# EAGLE design Group 13 Layout and sch v4 (EAGLE 9.2.0)
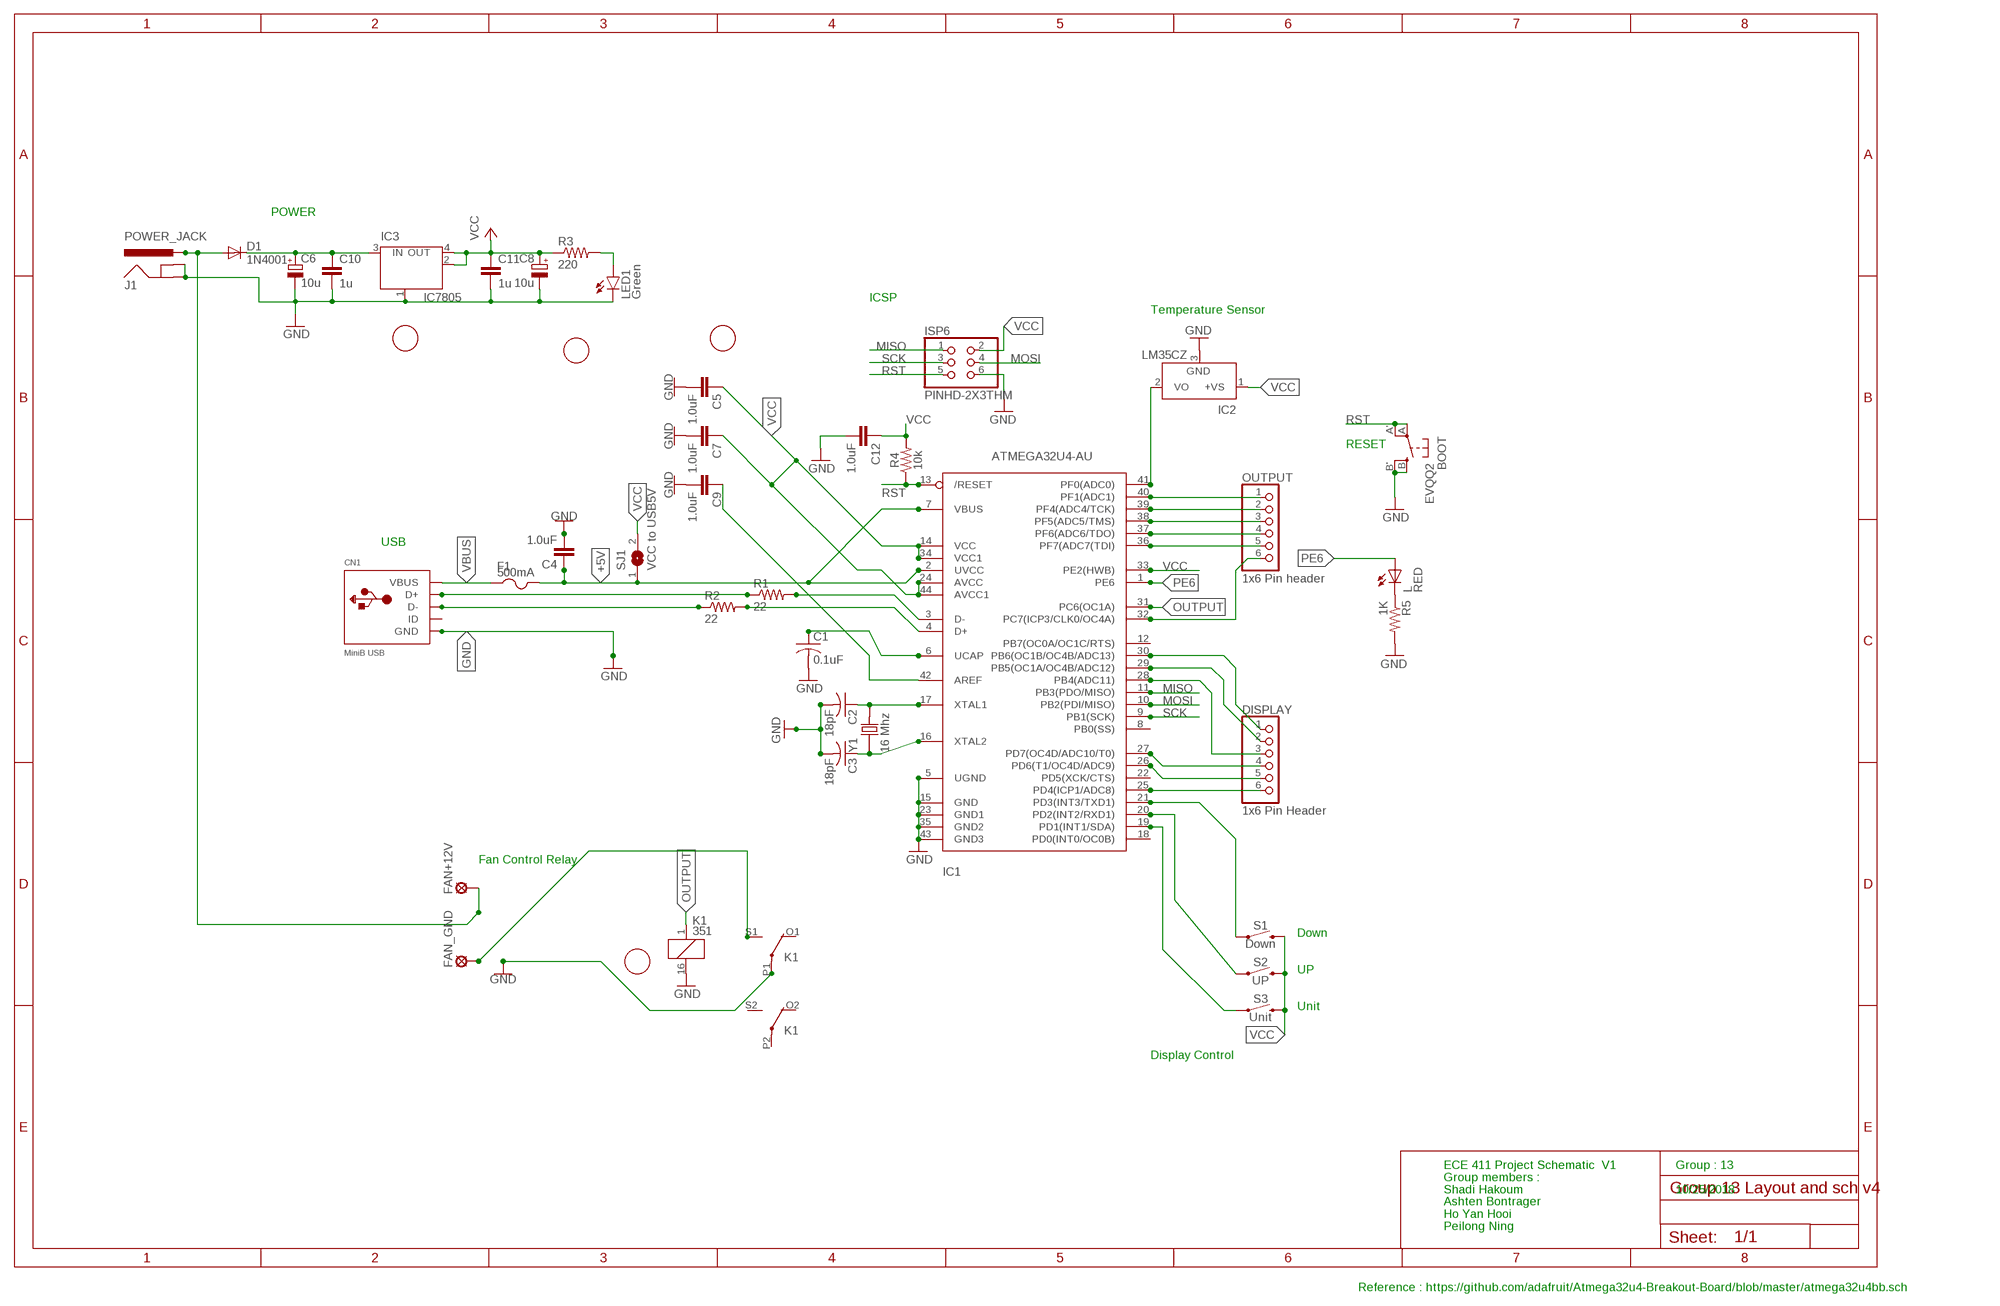
[diagram p0: schematic, sheet 1]

## Parts
BOOT  EVQQ2  [EVQ-Q2]
C1  0.1uF  C-USC0805K  [C0805K]
C2  18pF  C-USC0805K  [C0805K]
C3  18pF  C-USC0805K  [C0805K]
C4  1.0uF  1.0UF-0603-16V-10%  [0603]
C5  1.0uF  1.0UF-0603-16V-10%  [0603]
C6  10u  CPOL-EUC  [PANASONIC_C]
C7  1.0uF  1.0UF-0603-16V-10%  [0603]
C8  10u  CPOL-EUC  [PANASONIC_C]
C9  1.0uF  1.0UF-0603-16V-10%  [0603]
C10  1u  C-EUC0805  [C0805]
C11  1u  C-EUC0805  [C0805]
C12  1.0uF  1.0UF-0603-16V-10%  [0603]
CN1  MiniB USB  USBMINIB  [USB-MINIB]
D1  1N4001  BYT85  [DO220S]
DISPLAY  1x6 Pin Header  PINHD-1X6B  [1X06-BIG]
F1  500mA  PTCFUSE-1206  [R1206]
FAN+12V  LSP10  [LSP10]
FAN_GND  LSP11  [LSP11]
IC1  ATMEGA32U4-AU  [TQFP44]
IC2  LM35CZ  [TO92]
IC3  IC7805  MC33269ST-3.3T3  [SOT223]
ISP6  PINHD-2X3THM  [ISP6]
J1  POWER_JACK  [POWER_JACK_PTH]
K1  351  [351]
L  RED  LEDCHIPLED_0805  [CHIPLED_0805]
LED1  Green  LED5MM  [LED5MM]
OUTPUT  1x6 Pin header  PINHD-1X6B  [1X06-BIG]
R1  22  R-US_R0805  [R0805]
R2  22  R-US_R0805  [R0805]
R3  220  R-US_R0805  [R0805]
R4  10k  10KOHM-HORIZ_KIT-1/6W-5%  [AXIAL-0.3-KIT]
R5  1K  R-US_R0805  [R0805]
S1  Down  MOMENTARY-SWITCH-SPST-PTH-6.0MM  [TACTILE_SWITCH_PTH_6.0MM]
S2  UP  MOMENTARY-SWITCH-SPST-PTH-6.0MM  [TACTILE_SWITCH_PTH_6.0MM]
S3  Unit  MOMENTARY-SWITCH-SPST-PTH-6.0MM  [TACTILE_SWITCH_PTH_6.0MM]
SJ1  VCC to USB5V  SJ  [SJ]
U$1  FIDUCIAL  [FIDUCIAL_1MM]
U$2  FIDUCIAL  [FIDUCIAL_1MM]
U$3  FIDUCIAL  [FIDUCIAL_1MM]
U$6  FIDUCIAL  [FIDUCIAL_1MM]
Y1  16 Mhz  ECS-160-20-1X  [XTAL_ECS-160-20-1X]

## Nets
3.3V: C1.1 IC1.6(UCAP)
+5V: C4.1 F1.2 IC1.2(UVCC) IC1.7(VBUS) SJ1.1
D+: CN1.D+ R1.1
D-: CN1.D- R2.1
GND: BOOT.B'(S1) BOOT.B(S) C1.2 C2.2 C3.2 C4.2 C5.2 C6.- C7.2 C8.- C9.2 C10.2 C11.2 C12.2 CN1.GND IC1.5(UGND) IC1.15(GND) IC1.23(GND1) IC1.35(GND2) IC1.43(GND3) IC2.3(GND) IC3.1(GND/ADJ) ISP6.6 J1.GND J1.GNDBREAK K1.16 K1.P1(2:P) LED1.K(C) R5.2
MISO: IC1.11(PB3(PDO/MISO)) ISP6.1
MOSI: IC1.10(PB2(PDI/MISO)) ISP6.4
N$1: DISPLAY.6 IC1.25(PD4(ICP1/ADC8))
N$2: C6.+ C10.1 D1.C IC3.3(IN)
N$3: IC1.3(D-) R1.2
N$4: IC1.4(D+) R2.2
N$5: LED1.A R3.2
N$7: IC1.40(PF1(ADC1)) OUTPUT.1
N$8: C2.1 IC1.17(XTAL1) Y1.2
N$9: C3.1 IC1.16(XTAL2) Y1.1
N$10: L.C R5.1
N$11: IC1.38(PF5(ADC5/TMS)) OUTPUT.3
N$12: DISPLAY.5 IC1.26(PD6(T1/OC4D/ADC9))
N$13: FAN_GND.MP K1.S1(2:S)
N$16: DISPLAY.4 IC1.27(PD7(OC4D/ADC10/T0))
N$17: DISPLAY.3 IC1.28(PB4(ADC11))
N$18: DISPLAY.2 IC1.29(PB5(OC1A/OC4B/ADC12))
N$19: DISPLAY.1 IC1.30(PB6(OC1B/OC4B/ADC13))
N$20: IC1.19(PD1(INT1/SDA)) S3.1
N$21: IC1.20(PD2(INT2/RXD1)) S2.1
N$22: IC1.21(PD3(INT3/TXD1)) S1.1
N$24: IC1.37(PF6(ADC6/TDO)) OUTPUT.4
N$25: IC1.36(PF7(ADC7(TDI)) OUTPUT.5
N$26: IC1.32(PC7(ICP3/CLK0/OC4A)) OUTPUT.6
N$28: C9.1 IC1.42(AREF)
N$29: D1.A FAN+12V.MP J1.PWR
OUTPUT: IC1.31(PC6(OC1A)) K1.1
PE6: IC1.1(PE6) L.A
PF4: IC1.39(PF4(ADC4/TCK)) OUTPUT.2
PF7: IC1.41(PF0(ADC0)) IC2.2(VO)
RST: BOOT.A'(P1) BOOT.A(P) IC1.13(/RESET) ISP6.5 R4.P$1
SCK: IC1.9(PB1(SCK)) ISP6.3
VBUS: CN1.VBUS F1.1
VCC: C5.1 C7.1 C8.+ C11.1 C12.1 IC1.14(VCC) IC1.24(AVCC) IC1.33(PE2(HWB)) IC1.34(VCC1) IC1.44(AVCC1) IC2.1(+VS) IC3.2(OUT) IC3.4(OUT) ISP6.2 R3.1 R4.P$2 S1.3 S2.3 S3.3 SJ1.2
Unconnected: CN1.ID IC1.8(PB0(SS)) IC1.12(PB7(OC0A/OC1C/RTS)) IC1.18(PD0(INT0/OC0B)) IC1.22(PD5(XCK/CTS)) K1.O1(2:O) K1.O2(3:O) K1.P2(3:P) K1.S2(3:S)

## Notes on the sheet
- POWER
- ICSP
- Temperature Sensor
- RESET
- USB
- Fan Control Relay
- Down
- UP
- Unit
- Display Control
- ECE 411 Project Schematic  V1 | Group : 13
- Group members :
- Shadi Hakoum | 10/25/2018
- Ashten Bontrager
- Ho Yan Hooi
- Peilong Ning
- Reference : https://github.com/adafruit/Atmega32u4-Breakout-Board/blob/master/atmega32u4bb.sch

## Library data of the parts
BOOT = adaprog:EVQQ2
C1-C3 = adafruit:C-US: CAPACITOR, American symbol
C4 C5 C7 C9 C12 = SparkFun-Capacitors:1.0UF: 1µF ceramic capacitors A capacitor is a passive two-terminal electrical component used to store electrical energy temporarily in an electric field.; PROD_ID: CAP-00868
C6 C8 = rcl:CPOL-EU: POLARIZED CAPACITOR, European symbol; SPICEPREFIX: C
C10 C11 = rcl:C-EU: CAPACITOR, European symbol; SPICEPREFIX: C
CN1 = adafruit:USB: USB Connectors USBMINIB - Surface Mount Female Mini-B USB Connector 4UConnector: 06564 By microbuilder.eu Thru-hole RA Female Mini-B USB Connector 4UConnector: 18732 By ladyada.net
D1 = diode:BYT85: DIODE
DISPLAY OUTPUT = adafruit:PINHD-1X6: PIN HEADER
F1 = adafruit:PTCFUSE: PTC fuses, resettable thermistors
FAN+12V = solpad:LSP10: SOLDER PAD drill 1.0 mm, distributor Buerklin, 12H555
FAN_GND = solpad:LSP11: SOLDER PAD drill 1.1 mm
IC1 = adaprog:ATMEGA32U4
IC2 = lm35:LM35: Single-Supply Centigrade Temperature Sensor Vout = (10mV/°C x Temp °C) +5mmmV Source: http://www.national.com/ds/LM/LM35.pdf
IC3 = linear:MC33269ST*: Adjustable Output Low Dropout Voltage Regulator 800 mA Source: http://www.onsemi.com/pub/Collateral/MC33269-D.PDF
ISP6 = adaprog:PINHD-2X3
J1 = SparkFun-Connectors:POWER_JACK: Power Jack Connector This is the standard 5.5mm barrel jack for power. The PTH is the most common, proven, reliable, footprint. The Slot footprint only works if the mill layer is transmitted to the PCB fab house so be warned. Here are the connectors we sell at SparkFun: DC Barrel Power Jack/Connector <https://www.sparkfun.com/products/119> (PRT-00119) DC Barrel Power Jack/Connector (SMD) <https://www.sparkfun.com/products/12748> (PRT-12748) DC Barrel Jack Adapter - Breadboard Compatible <https://www.sparkfun.com/products/10811> (PRT-10811) It is used on this SparkFun product (and many, many others): SparkFun RedBoard - Programmed with Arduino <https://www.sparkfun.com/products/12757> (DEV-12757) Also, if you need a mating power supply or connector, please check these out: Wall Adapter Power Supply - 9VDC 650mA <https://www.sparkfun.com/products/298> (TOL-00298) DC Barrel Jack Adapter - Male <https://www.sparkfun.com/products/10287> (PRT-10287); PROD_ID: CONN-08197
K1 = relay:351: RELAY 2 x switch, Omron; OC_FARNELL: unknown; OC_NEWARK: unknown
L = adafruit:LED: LED
LED1 = led:LED: LED
R1 R2 R5 = adafruit:R-US_: RESISTOR, American symbol
R3 = rcl:R-US_: RESISTOR, American symbol; SPICEPREFIX: R
R4 = SparkFun-Resistors:10KOHM: 10kΩ resistor A resistor is a passive two-terminal electrical component that implements electrical resistance as a circuit element. Resistors act to reduce current flow, and, at the same time, act to lower voltage levels within circuits. - Wikipedia; PROD_ID: RES-08375
S1-S3 = SparkFun-Switches:MOMENTARY-SWITCH-SPST: Momentary Switch (Pushbutton) - SPST Normally-open (NO) SPST momentary switches (buttons, pushbuttons). Variants PTH-12MM - 12mm square, through-hole Momentary Pushbutton Switch - 12mm Square <https://www.sparkfun.com/products/9190> (COM-09190) PTH-6.0MM, PTH-6.0MM-KIT - 6.0mm square, through-hole Mini Pushbutton Switch <https://www.sparkfun.com/products/97> (COM-00097) KIT package intended for soldering kit's - only one side of pads' copper is exposed. PTH-RIGHT-ANGLE-KIT - Right-angle, through-hole Right Angle Tactile Button <https://www.sparkfun.com/products/10791> - Used on SparkFun BigTime Watch Kit <https://www.sparkfun.com/products/11734> SMD-12MM - 12mm square, surface-mount Tactile Button - SMD (12mm) <https://www.sparkfun.com/products/12993> (COM-12993) Used on SparkFun PicoBoard <https://www.sparkfun.com/products/11888> SMD-4.5MM - 4.5mm Square Trackball Switch Used on SparkFun Blackberry Trackballer Breakout <https://www.sparkfun.com/products/13169> SMD-4.6MMX2.8MM - 4.60mm x 2.80mm, surface mount Used on SparkFun SAMD21 Mini Breakout <https://www.sparkfun.com/products/13664> SMD-5.2MM, SMD-5.2-REDUNDANT - 5.2mm square, surface-mount Mini Pushbutton Switch - SMD <https://www.sparkfun.com/products/8720> (COM-08720) Used on Arduino Pro Mini <https://www.sparkfun.com/products/11114> REDUNDANT package connects both switch circuits together SMD-6.0X3.5MM - 6.0 x 3.5mm, surface mount Momentary Reset Switch SMD <https://www.sparkfun.com/products/8229> (COM-08229) SMD-6.2MM-TALL - 6.2mm square, surface mount Tactile Button - SMD (6mm) <https://www.sparkfun.com/products/12992> Used on SparkFun Digital Sandbox <https://www.sparkfun.com/products/12651> SMD-RIGHT-ANGLE - Right-angle, surface mount Used on SparkFun Block for Intel® Edison - Arduino <https://www.sparkfun.com/products/13036>; PROD_ID: SWCH-08441; SF_SKU: COM-00097
SJ1 = jumper:SJ: SMD solder JUMPER
U$1-U$3 U$6 = adafruit:FIDUCIAL: For use by pick and place machines to calibrate the vision/machine, 1mm By microbuilder.eu
Y1 = ECS-160-20-1X:ECS-160-20-1X: Crystal HC49/U T/H; DESCRIPTION: Crystal 16MHz ±30ppm _Tol_ ±50ppm _Stability_ 20pF FUND 20Ohm 2-Pin HC-49/UX Thru-Hole Bulk; DIGI-KEY_PART_NUMBER: X1033-ND; DIGI-KEY_PURCHASE_URL: https://www.digikey.com/product-detail/en/ecs-inc/ECS-160-20-1X/X1033-ND/827525?utm_source=snapeda&utm_medium=aggregator&utm_campaign=symbol; MF: ECS Inc.; MP: ECS-160-20-1X; PACKAGE: HC49/U ECS International

## Board
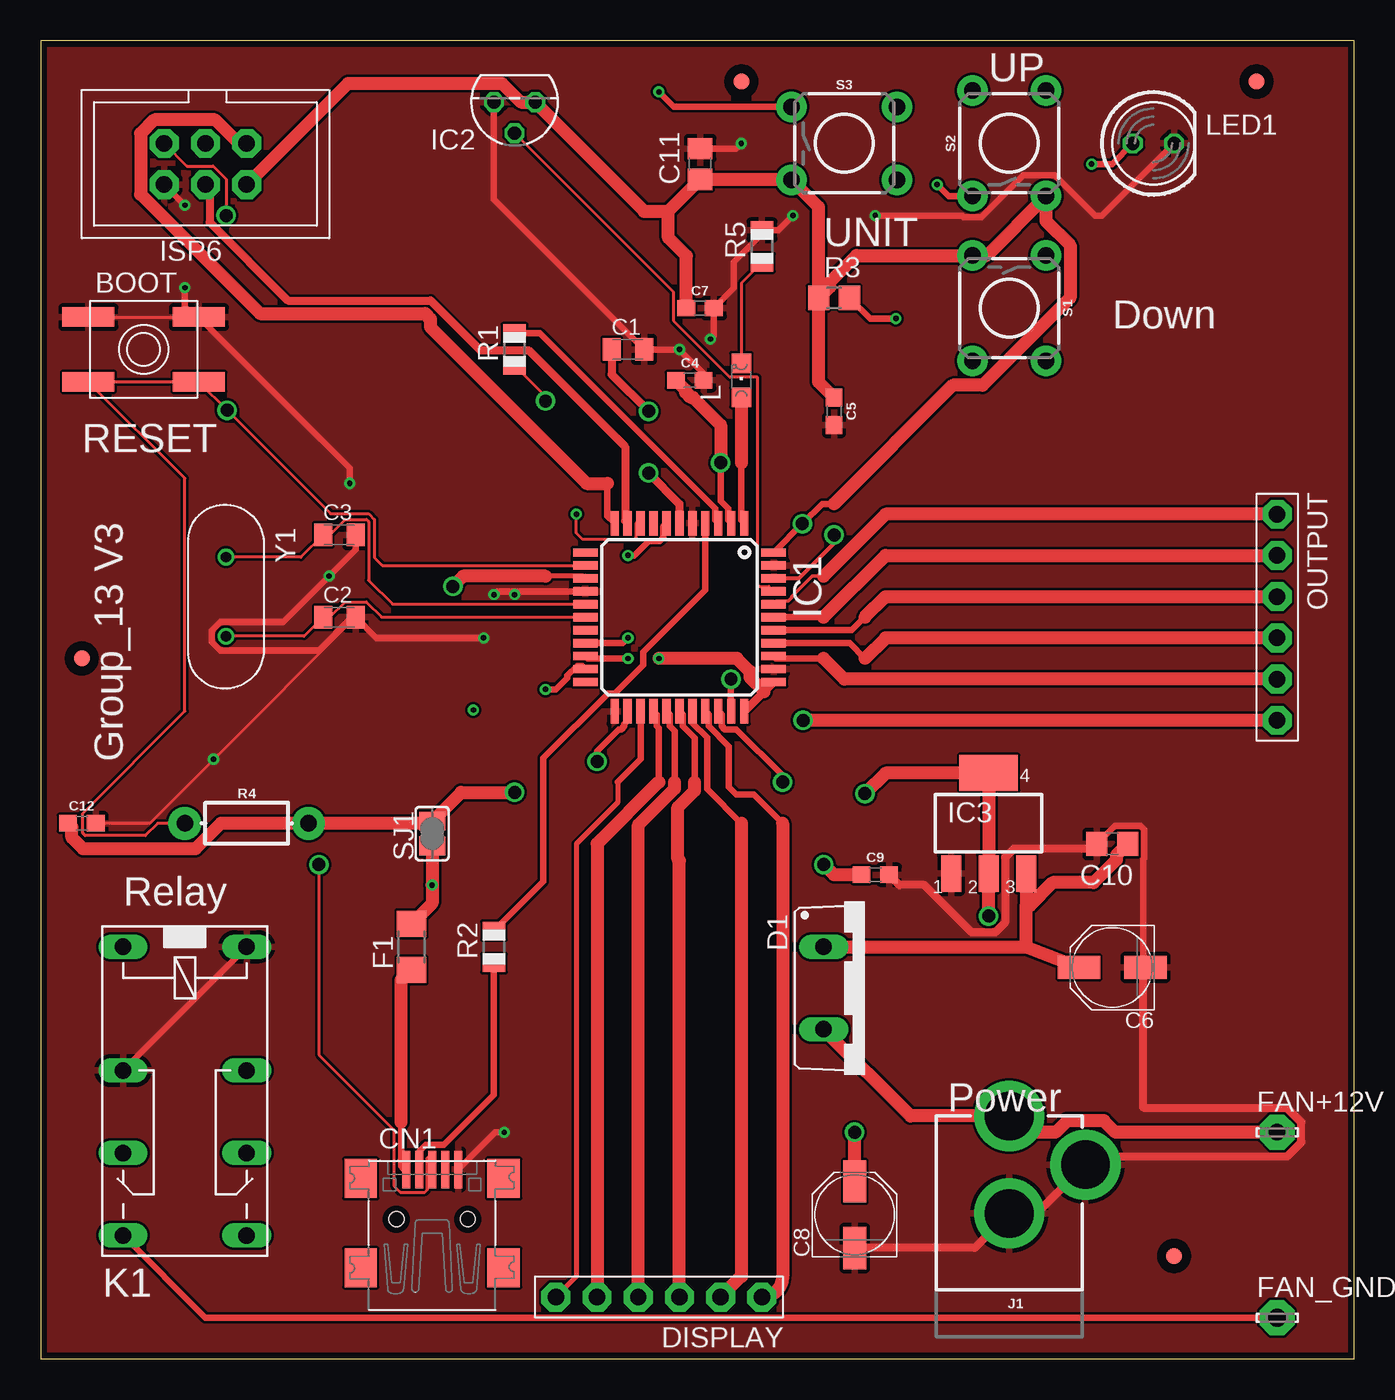
[diagram p1: board, top side]
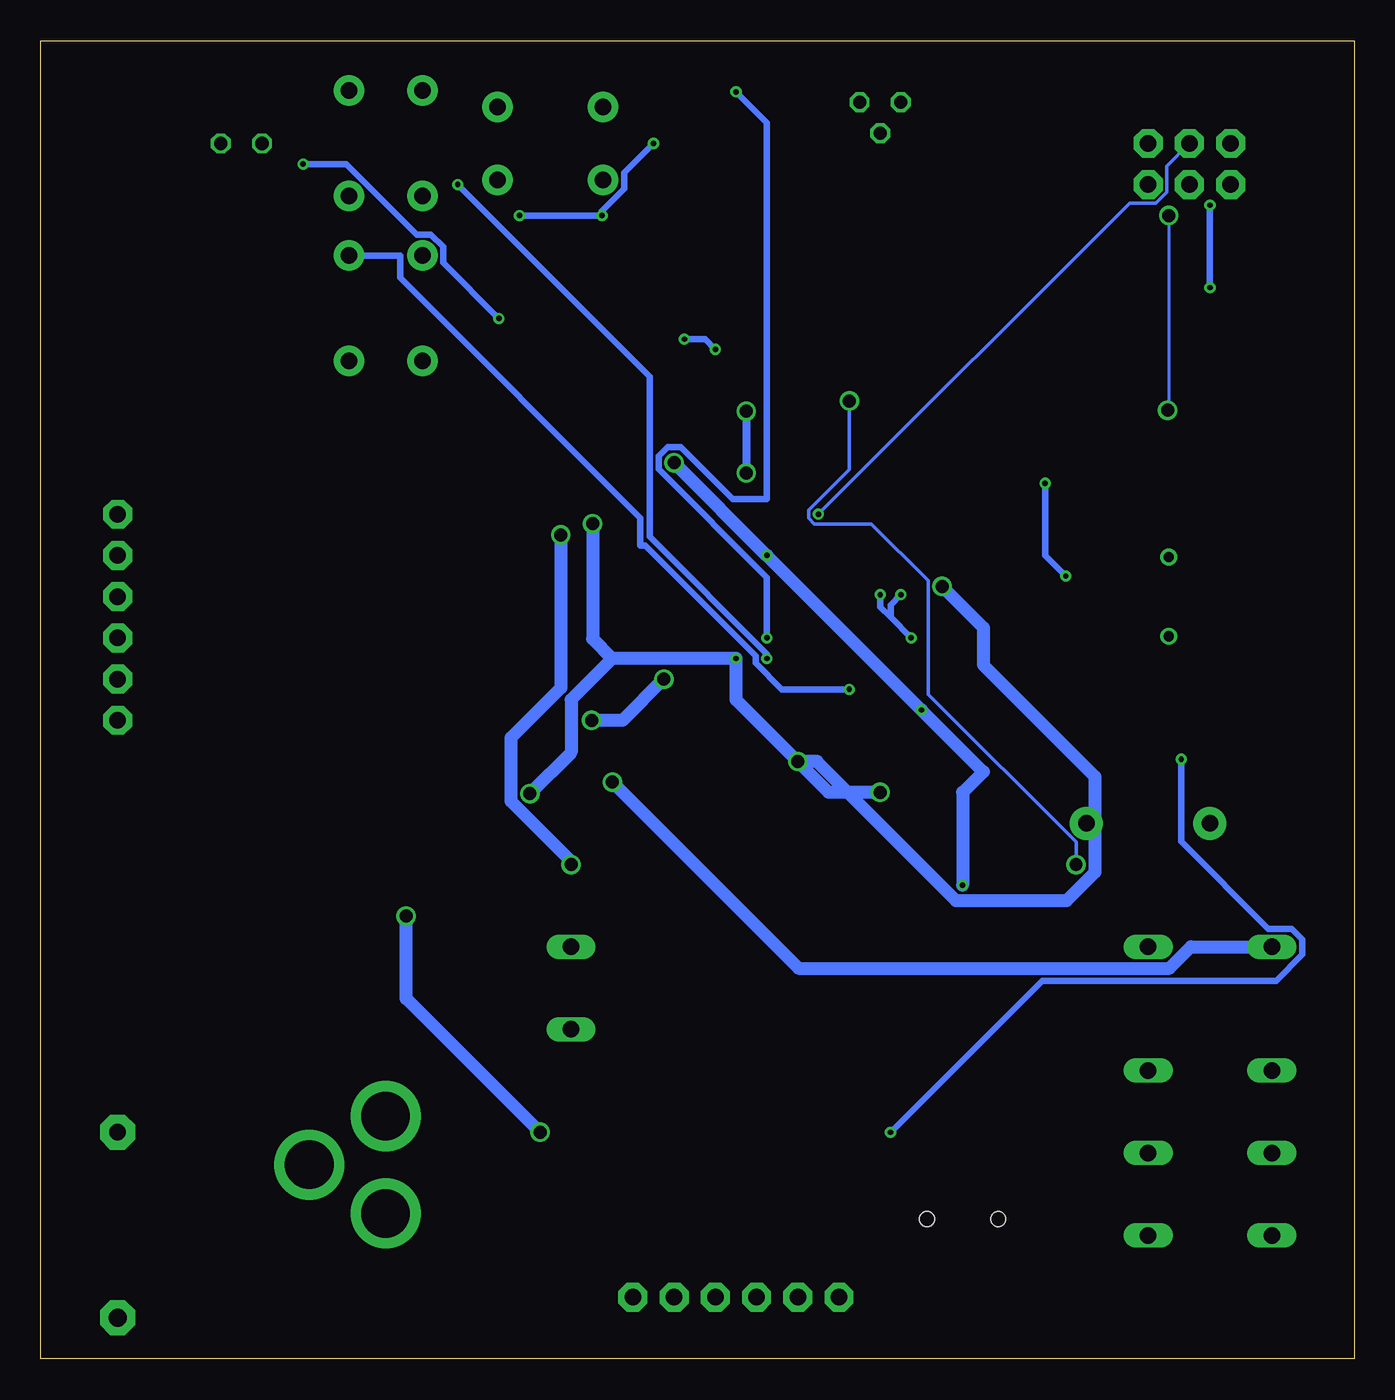
[diagram p2: board, bottom side, seen from below]

Size 80.95 x 81.27 mm. Coordinates in mm from the lower left corner, seen from the top.
Outline: 0,0 80.95,0 80.95,81.27 0,81.27 0,0
Copper layers (1*16): Top 0.0356mm / dielectric 1.5011mm / Bottom 0.0356mm
Design rules "LaenPCBOrder": minimum track width 6mil, minimum drill 13mil, track to track 6mil, track to pad 6mil, pad to pad 6mil, via to via 6mil, smd to smd 6mil, copper to edge 15mil, drill to drill 6mil, minimum pad ring 7mil, minimum via ring 7mil, stop-mask expansion 3mil, vias tented up to drill 0mil, thermal gap 10mil

### Footprints (pad centres in the part's own frame; a part is rotated, then mirrored left to right if it is on the bottom)
EVQ-Q2 = smd 3.2 x 1.2: A -3.4,-2; A' 3.4,-2; B -3.4,2; B' 3.4,2
C0805K = smd 1.1 x 1.4: 1 -1,0; 2 1,0
0603 = smd 1.1 x 1: 1 -0.85,0; 2 0.85,0
PANASONIC_C = smd 2.6 x 1.4: + 2.05,0; - -2.05,0
C0805 = smd 1.3 x 1.5: 1 -0.95,0; 2 0.95,0
USB-MINIB = smd 0.5 x 2.308: D+ 0,4.064; D- -0.8,4.064; GND 1.6,4.064; ID 0.8,4.064; VBUS -1.6,4.064 | smd 2 x 2.4: GND1 -4.4,-2; GND2 -4.4,3.5; GND3 4.4,3.5; GND4 4.4,-2 | hole 0.9: -2.2,1; 2.2,1
DO220S = drill 1.016 long: A 2.54,-2.54; C -2.54,-2.54
1X06-BIG = drill 1.016 pad 1.778 octagon: 1 -6.35,0; 2 -3.81,0; 3 -1.27,0; 4 1.27,0; 5 3.81,0; 6 6.35,0
R1206 = smd 1.6 x 1.803: 1 -1.422,0; 2 1.422,0
LSP10 = drill 1.016 pad 2.159 octagon: MP 0,0
LSP11 = drill 1.118 pad 2.159 octagon: MP 0,0
TQFP44 = smd 1.5 x 0.5: 1 -5.8,4; 2 -5.8,3.2; 3 -5.8,2.4; 4 -5.8,1.6; 5 -5.8,0.8; 6 -5.8,0; 7 -5.8,-0.8; 8 -5.8,-1.6; 9 -5.8,-2.4; 10 -5.8,-3.2; 11 -5.8,-4; 23 5.8,-4; 24 5.8,-3.2; 25 5.8,-2.4; 26 5.8,-1.6; 27 5.8,-0.8; 28 5.8,0; 29 5.8,0.8; 30 5.8,1.6; 31 5.8,2.4; 32 5.8,3.2; 33 5.8,4 | smd 0.5 x 1.5: 12 -4,-5.8; 13 -3.2,-5.8; 14 -2.4,-5.8; 15 -1.6,-5.8; 16 -0.8,-5.8; 17 0,-5.8; 18 0.8,-5.8; 19 1.6,-5.8; 20 2.4,-5.8; 21 3.2,-5.8; 22 4,-5.8; 34 4,5.8; 35 3.2,5.8; 36 2.4,5.8; 37 1.6,5.8; 38 0.8,5.8; 39 0,5.8; 40 -0.8,5.8; 41 -1.6,5.8; 42 -2.4,5.8; 43 -3.2,5.8; 44 -4,5.8
TO92 = drill 0.813 octagon: 1 -1.27,0; 2 0,1.905; 3 1.27,0
SOT223 = smd 1.219 x 2.235: 1 -2.311,-3.099; 2 0,-3.099; 3 2.311,-3.099 | smd 3.6 x 2.2: 4 0,3.099
ISP6 = drill 1.016 pad 1.778 octagon: 1 -2.54,-1.27; 2 -2.54,1.27; 3 0,-1.27; 4 0,1.27; 5 2.54,-1.27; 6 2.54,1.27
POWER_JACK_PTH = drill 2.997 pad 4.318: GND 0,7.7; GNDBREAK 4.7,10.7; PWR 0,13.7
351 = drill 1.016 long: 1 -3.81,-3.81; 16 -3.81,3.81; O1 8.89,-3.81; O2 8.89,3.81; P1 3.81,-3.81; P2 3.81,3.81; S1 13.97,-3.81; S2 13.97,3.81
CHIPLED_0805 = smd 1.2 x 1.2: A 0,-1.05; C 0,1.05
LED5MM = drill 0.813 octagon: A -1.27,0; K 1.27,0
R0805 = smd 1.1 x 1.4: 1 -1,0; 2 1,0
R0805' = smd 1.3 x 1.5: 1 -0.95,0; 2 0.95,0
AXIAL-0.3-KIT = drill 1.016 pad 2.032: P$1 -3.81,0; P$2 3.81,0
TACTILE_SWITCH_PTH_6.0MM = drill 1.016 pad 1.88: 1 -3.251,2.261; 2 3.251,2.261; 3 -3.251,-2.261; 4 3.251,-2.261
SJ = smd 1.168 x 1.6: 1 -0.762,0; 2 0.762,0
FIDUCIAL_1MM = smd 1 x 1: 1 0,0
XTAL_ECS-160-20-1X = drill 0.63 pad 1.03: 1 -2.44,0; 2 2.44,0

### Placement (x,y rotation side)
BOOT  6.35,62.23 0 top
C1  36.2,62.23 0 top
C2  18.41,45.72 0 top
C3  18.41,50.8 0 top
C4  40.01,60.33 0 top
C5  48.9,58.42 270 top
C6  66.04,24.13 180 top
C7  40.64,64.77 0 top
C8  50.16,8.89 90 top
C9  51.44,29.84 0 top
C10  66.04,31.75 180 top
C11  40.64,73.66 90 top
C12  2.54,33.02 0 top
CN1  24.13,7.62 0 top
D1  50.8,22.86 270 top
DISPLAY  38.1,3.81 180 top
F1  22.86,25.4 90 top
FAN+12V  76.2,13.97 0 top
FAN_GND  76.2,2.54 0 top
IC1  39.37,45.72 270 top
IC2  29.21,77.47 180 top
IC3  58.42,33.02 0 top
ISP6  10.16,73.66 180 top
J1  59.69,1.27 0 top
K1  8.89,21.59 270 top
L  43.18,60.33 0 top
LED1  68.58,74.93 0 top
OUTPUT  76.2,45.72 270 top
R1  29.21,62.23 90 top
R2  27.94,25.4 90 top
R3  220  [R0805']  48.9,65.41 0 top
R4  12.7,33.02 0 top
R5  44.45,68.58 90 top
S1  59.69,64.77 270 top
S2  59.69,74.93 90 top
S3  49.53,74.93 0 top
SJ1  24.13,32.38 90 top
U$1  74.93,78.74 0 top
U$2  43.18,78.74 0 top
U$3  69.85,6.35 0 top
U$6  2.54,43.18 0 top
Y1  11.43,46.99 270 top

### Tracks (layer width: path | path; a pad name or v marks a point on that pad's centre or on a via)
3.3V  (via drill 0.8)
  Top 0.508: C1.1 35.2,60.69 v37.47,58.42 | v37.47,54.61 39.37,52.7 IC1.6
  Bottom 0.508: v37.47,58.42 v37.47,54.61
+5V  (via drill 0.33, 0.8)
  Top 0.406: IC1.2 42.38,51.71 42.38,52.42 41.91,52.88 v41.91,55.24 | IC1.7 38.38,51.33 38.38,50.62 38.17,50.41 37.47,50.41 36.58,49.53 v36.2,49.53
  Top 0.813: SJ1.1 v24.13,29.21 24.13,28.09 F1.2 | v41.91,55.24 41.91,57.57 40.21,59.27 40.07,59.27 39.75,59.59 39.75,59.73 C4.1
  Bottom 0.813: v41.91,55.24 v36.2,49.53 v26.67,40.01 22.86,36.2 24.13,34.92 v24.13,29.21
D+  (via drill 0.8)
  Top 0.2: R1.1 31.11,59.33 v31.11,59.05 | v17.14,30.48 17.14,18.75 21.77,14.13 21.77,10.68 22.18,10.28 23.68,10.28 23.83,10.43 23.83,12.4 24.13,12.7 CN1.D+
  Bottom 0.203: v17.14,30.48 17.14,31.86 26.25,40.97 26.25,47.98 29.75,51.47 33.27,51.47 33.62,51.82 33.62,52.32 31.11,54.82 v31.11,59.05
D-
  Top 0.406: R2.1 27.94,16.29 24.84,13.19 23.73,13.19 23.38,12.84 23.38,11.73 CN1.D-
GND  (via drill 0.33)
  Top 0.2: 65.07,31.59 64.93,31.59 | C2.2 v10.66,36.97 6.71,33.02 C12.2 | BOOT.B 9.53,64.23 BOOT.B'
  Top 0.254: 56.3,29.92 IC3.1 | 64.93,31.59 C10.2
  Top 0.406: LED1.K 65.41,70.48 64.98,70.48 62.49,72.97 60.56,72.97 57.97,70.38 56.89,70.38 56.79,70.48 v51.44,70.48 | v46.35,70.48 45.45,69.58 R5.2 44.45,69.33 42.72,67.61 42.72,66 C7.2 41.49,63.08 v41.27,62.87 | IC2.3 27.94,71.48 C1.2 v39.37,62.23 40.85,60.74 C4.2 | C11.2 42.86,74.61 v43.18,74.93 | ISP6.6 v8.89,71.12 | v8.89,66.04 8.89,64.86 9.53,64.23 | BOOT.B' 19.05,54.93 v19.05,53.98 | C3.2 19.41,49.9 v17.78,48.26 14.94,45.42 11.07,45.42 10.56,44.91 10.56,44.19 11.07,43.68 17.13,43.68 19.17,45.72 C2.2 20.68,44.45 v27.3,44.45 | 44.62,48.92 IC1.43 | K1.P1 K1.16 | C10.2 65.98,32.64 65.98,32.65 66.19,32.86 67.79,32.86 68,32.65 68,30.85 67.94,30.8 67.94,23.98 | 67.94,23.5 67.94,23.98 | 67.94,23.98 C6.- | CN1.GND 28.02,13.97 v28.57,13.97 | IC1.15 28.14,47.32 v27.94,47.12
  Top 0.508: C8.- 57.56,6.84 J1.GND 61.39,8.97 J1.GNDBREAK 64.9,12.48 76.81,12.48 77.69,13.36 77.69,14.59 76.81,15.46 68.01,15.46 67.94,15.53 67.94,23.98 | C10.2 64.78,31.45 59.95,31.45 59.44,30.93 59.44,26.9 58.84,26.3 57.37,26.3 54.46,29.21 52.92,29.21 C9.2
  Bottom 0.406: v51.44,70.48 v46.35,70.48 46.35,70.76 44.98,72.13 44.98,73.13 v43.18,74.93 | v41.27,62.87 40.01,62.87 v39.37,62.23 | v8.89,71.12 v8.89,66.04 | v19.05,53.98 19.05,49.53 v17.78,48.26 | v27.3,44.45 28.57,45.72 | 28.57,45.72 29.21,46.35 v29.21,47.12 | v10.66,36.97 10.66,31.89 5.29,26.52 3.85,26.52 3.2,25.86 3.2,24.94 4.82,23.32 19.23,23.32 v28.57,13.97 | v27.94,47.12 28.57,46.48 28.57,45.72
  pour Top: 0,81.28 81.28,81.28 81.28,0 0,0
MISO
  Top 0.406: 34.92,53.98 34.92,51.97 IC1.11
  Top 0.813: 34.92,53.98 33.66,53.98 24.02,63.61 24.02,64.11 23.69,64.44 13.52,64.44 6.17,71.79 6.17,75.53 7.02,76.38 10.76,76.38 12.21,74.93 ISP6.1
MOSI
  Top 0.508: IC1.10 36.03,51.66 36.03,56.24 30.08,62.19 27.09,62.19 24.03,65.25 15.24,65.25 10.42,70.07 10.42,72.13 ISP6.4
N$1
  Top 0.305: 35.56,35.56 35.56,34.29 33.02,31.75 33.02,5.08 DISPLAY.6
  Top 0.406: IC1.25 36.97,36.97 35.56,35.56
N$2
  Top 0.813: D1.C 60.73,25.4 | 60.73,25.4 60.73,27.94 | IC3.3 60.73,27.94 | 60.73,25.4 C6.+ | C10.1 66.3,31.06 66.3,30.77 64.89,29.36 62.38,29.36 60.96,27.94 60.73,27.94
N$3
  Top 0.406: IC1.3 41.58,51.71 41.58,52.42 30.76,63.23 R1.2
N$4
  Top 0.406: R2.2 30.99,29.45 30.99,37.04 34.97,41.03 35.39,41.03 37.14,42.78 37.14,43.58 40.97,47.4 IC1.4
N$5  (via drill 0.33)
  Top 0.406: LED1.A 66.04,73.66 v64.77,73.66 | v52.7,64.14 51.12,64.14 R3.2
  Bottom 0.406: v52.7,64.14 56.13,67.56 56.13,68.56 56.89,69.32 57.76,69.32 62.1,73.66 v64.77,73.66
N$7
  Top 0.203: 48.26,48.26 47.55,48.26 46.28,46.99 46.28,46.92 46.07,46.71 45.36,46.71 IC1.40
  Top 0.813: OUTPUT.1 52.07,52.07 48.26,48.26
N$8
  Top 0.2: Y1.2 16.25,44.55 C2.1 17.81,45.72 18.76,46.67 20.07,46.67 21.02,45.72 IC1.17
N$9
  Top 0.2: Y1.1 16.05,49.43 C3.1 17.81,50.8 18.76,51.75 20.07,51.75 20.22,51.6 20.22,48 21.7,46.52 IC1.16
N$10
  Top 0.2: R5.1 43.18,66.31 L.C
N$11
  Top 0.406: IC1.38 50,44.92 50.8,45.72
  Top 0.813: 50.8,45.72 52.07,46.99 OUTPUT.3
N$12
  Top 0.406: IC1.26 37.96,39.73 37.96,39.02 38.1,38.89 38.1,35.56
  Top 0.813: 38.1,35.56 34.29,31.75 DISPLAY.5
N$13
  Top 0.406: K1.S1 10.16,2.54 FAN_GND.MP
N$16
  Top 0.406: IC1.27 38.76,39.73 38.76,39.02 39.06,38.72 39.06,35.56
  Top 0.813: DISPLAY.4 36.83,32.92 39.06,35.16 39.06,35.56
N$17
  Top 0.406: IC1.28 39.56,39.73 39.56,39.02 40.31,38.28 40.31,35.56
  Top 0.813: DISPLAY.3 39.37,30.72 39.27,30.82 39.27,34 40.31,35.04 40.31,35.56
N$18
  Top 0.406: IC1.29 40.17,39.21 41.07,38.3 41.07,35.13 43.18,33.02
  Top 0.813: 43.18,33.02 43.18,5.08 DISPLAY.2
N$19
  Top 0.406: IC1.30 41.16,39.73 41.16,39.02 42.42,37.77 42.42,35.24 42.86,34.8 43.94,34.8 45.72,33.02
  Top 0.813: 45.72,33.02 45.72,5.08 arc-90 DISPLAY.1
N$20  (via drill 0.33)
  Top 0.406: S3.1 39.01,77.19 v38.1,78.11 | v36.2,44.45 35.87,44.12 IC1.19
  Bottom 0.406: v38.1,78.11 36.2,76.2 36.2,52.99 38.31,52.99 41.51,56.2 42.31,56.2 42.87,55.64 42.87,54.85 36.2,48.18 v36.2,44.45
N$21  (via drill 0.33)
  Top 0.406: S2.1 55.96,71.68 v55.24,72.39 | v36.2,43.18 33.71,43.18 IC1.20
  Bottom 0.406: v36.2,43.18 36.2,43.46 43.42,50.69 43.42,60.57 v55.24,72.39
N$22  (via drill 0.33)
  Top 0.406: v31.11,41.27 31.75,41.27 32.46,41.99 32.46,42.12 33.06,42.71 33.38,42.71 33.38,42.7 IC1.21
  Bottom 0.406: v31.11,41.27 35.28,41.27 36.89,42.89 36.89,43.33 43.7,50.13 43.98,50.13 43.98,51.83 58.8,66.65 58.8,68.02 S1.1
N$24
  Top 0.406: 50.8,43.18 49.86,44.12 IC1.37
  Top 0.813: OUTPUT.4 52.07,44.45 50.8,43.18
N$25
  Top 0.406: IC1.36 45.31,43.18 48.26,43.18
  Top 0.813: OUTPUT.5 49.53,41.91 48.26,43.18
N$26  (via drill 0.8)
  Top 0.406: IC1.32 42.55,39.95 v42.55,41.91
  Top 0.813: OUTPUT.6 v46.99,39.37
  Bottom 0.813: v42.55,41.91 45.09,39.37 v46.99,39.37
N$28  (via drill 0.8)
  Top 0.254: IC1.42 46.72,48.12 48.9,50.29 v48.9,50.8
  Top 0.813: C9.1 48.9,29.84 v48.26,30.48
  Bottom 0.813: v48.9,50.8 48.9,41.37 51.96,38.31 51.96,34.37 48.26,30.67 v48.26,30.48
N$29
  Top 0.813: FAN+12V.MP 66.23,13.97 65.52,14.69 63.26,14.69 62.55,13.97 60.69,13.97 J1.PWR 53.61,14.97 D1.A
OUTPUT  (via drill 0.8)
  Top 0.406: v45.72,35.56 45.72,35.97 42.88,38.81 42.17,38.81 41.96,39.02 41.96,39.73 IC1.31
  Bottom 0.813: K1.1 10.07,25.4 11.39,24.08 34.24,24.08 v45.72,35.56
PE6
  Top 0.406: 43.18,55.24 43.18,51.71 IC1.1
  Top 0.813: L.A 43.18,55.24
PF4
  Top 0.406: IC1.39 48.26,45.72
  Top 0.813: 48.26,45.72 52.07,49.53 OUTPUT.2
PF7
  Top 0.2: IC2.2 38.99,65.79 38.99,64.01 42.48,60.52 44.17,60.52 44.17,47.77 44.31,47.62 44.87,47.62 IC1.41
RST  (via drill 0.8)
  Top 0.2: 3.02,60.16 8.89,54.29 8.89,39.93 2.59,33.62 2.59,32.41 2.73,32.27 6.46,32.27 7.21,33.02 R4.P$1 | 3.02,60.16 BOOT.A | IC1.13 21.06,48.92 20.57,49.41 20.57,51.75 20.22,52.1 17.88,52.1 v11.49,58.48 BOOT.A' 3.08,60.23 3.02,60.16 | ISP6.5 9.02,73.53 10.63,73.53 11.43,72.73 v11.43,70.48
  Bottom 0.2: v11.43,70.48 11.43,58.55 v11.49,58.48
SCK  (via drill 0.33)
  Top 0.2: IC1.9 36.68,51.52 36.68,50.52 36.67,50.52 33.42,50.52 33.02,50.92 v33.02,52.07
  Bottom 0.203: v33.02,52.07 13.84,71.25 12.23,71.25 11.56,71.92 11.56,73.53 ISP6.3
VBUS
  Top 0.406: CN1.VBUS arc-90 22.23,11.99 22.23,14.61
  Top 0.813: 22.23,14.61 22.23,23.34 F1.1
VCC  (via drill 0.33, 0.8)
  Top 0.305: IC1.14 33.43,48.26 31.11,48.26
  Top 0.406: 48.9,52.7 48.16,52.7 v46.94,51.49 IC1.44 | v34.29,36.83 34.29,37.47 35.64,38.81 35.77,38.81 35.98,39.02 35.98,39.15 36.2,39.37 36.2,39.9 IC1.24
  Top 0.508: IC1.34 44.59,41.14 IC1.33
  Top 0.813: v50.8,34.85 52.07,36.12 IC3.4 IC3.2 v58.42,27.3 | ISP6.2 18.95,78.64 28.42,78.64 29.59,77.47 IC2.1 37.2,70.75 38.68,70.75 | C8.+ v50.16,13.97 | C12.1 1.93,32.78 1.93,32.14 2.63,31.45 9.54,31.45 11.12,33.02 R4.P$2 24,33.02 SJ1.2 25.91,34.92 v29.21,34.92 | C5.1 47.95,60.22 R3.1 | C7.1 39.79,68.01 38.68,69.12 38.68,70.75 | 38.68,70.75 C11.1 46.24,72.71 S3.3 47.95,71 R3.1 | R3.1 48.64,66.1 48.64,66.39 50.27,68.02 S1.3 58.29,68.02 S2.3 61.95,70.14 63.45,68.64 63.45,65.42 58.05,60.02 56.21,60.02 48.9,52.7 | 44.59,41.14 43.7,42.02 43.7,42.39 42.91,43.18 v38.1,43.18 | 31.11,48.26 26.04,48.26 v25.4,47.62
  Bottom 0.813: 45.72,43.18 v38.1,43.18 38.1,40.64 v34.29,36.83 | 45.72,43.18 48.26,40.64 48.26,37.39 v50.8,34.85 | v50.16,13.97 58.42,22.23 v58.42,27.3 | v29.21,34.92 32.38,34.92 v34.29,36.83 | v34.29,36.83 33.12,36.83 24.53,28.25 17.74,28.25 15.99,30 15.99,35.9 22.86,42.78 22.86,45.09 v25.4,47.62 | v46.94,51.49 46.94,44.4 45.72,43.18

### Text on the board
tPlace: Group_13 V3
tNames: UP | UNIT | Down | RESET | Relay | Power